# Altium project COB with RK3399.PrjPcb (part 4 of 5)

## Sheet MIPI CSI 0 and 1 Connectors.SchDoc: RK3399 COB Design V1.0
size A3; Author: ABC; Organization: Altium Limited; Address1: L3, 12a Rodborough Rd; Address2: Frenchs Forest; Address3: NSW; Address4: Australia 2086; DocumentNumber: 22; SheetNumber: 22; SheetTotal: 27; PROJECT CODE: A_V1.0
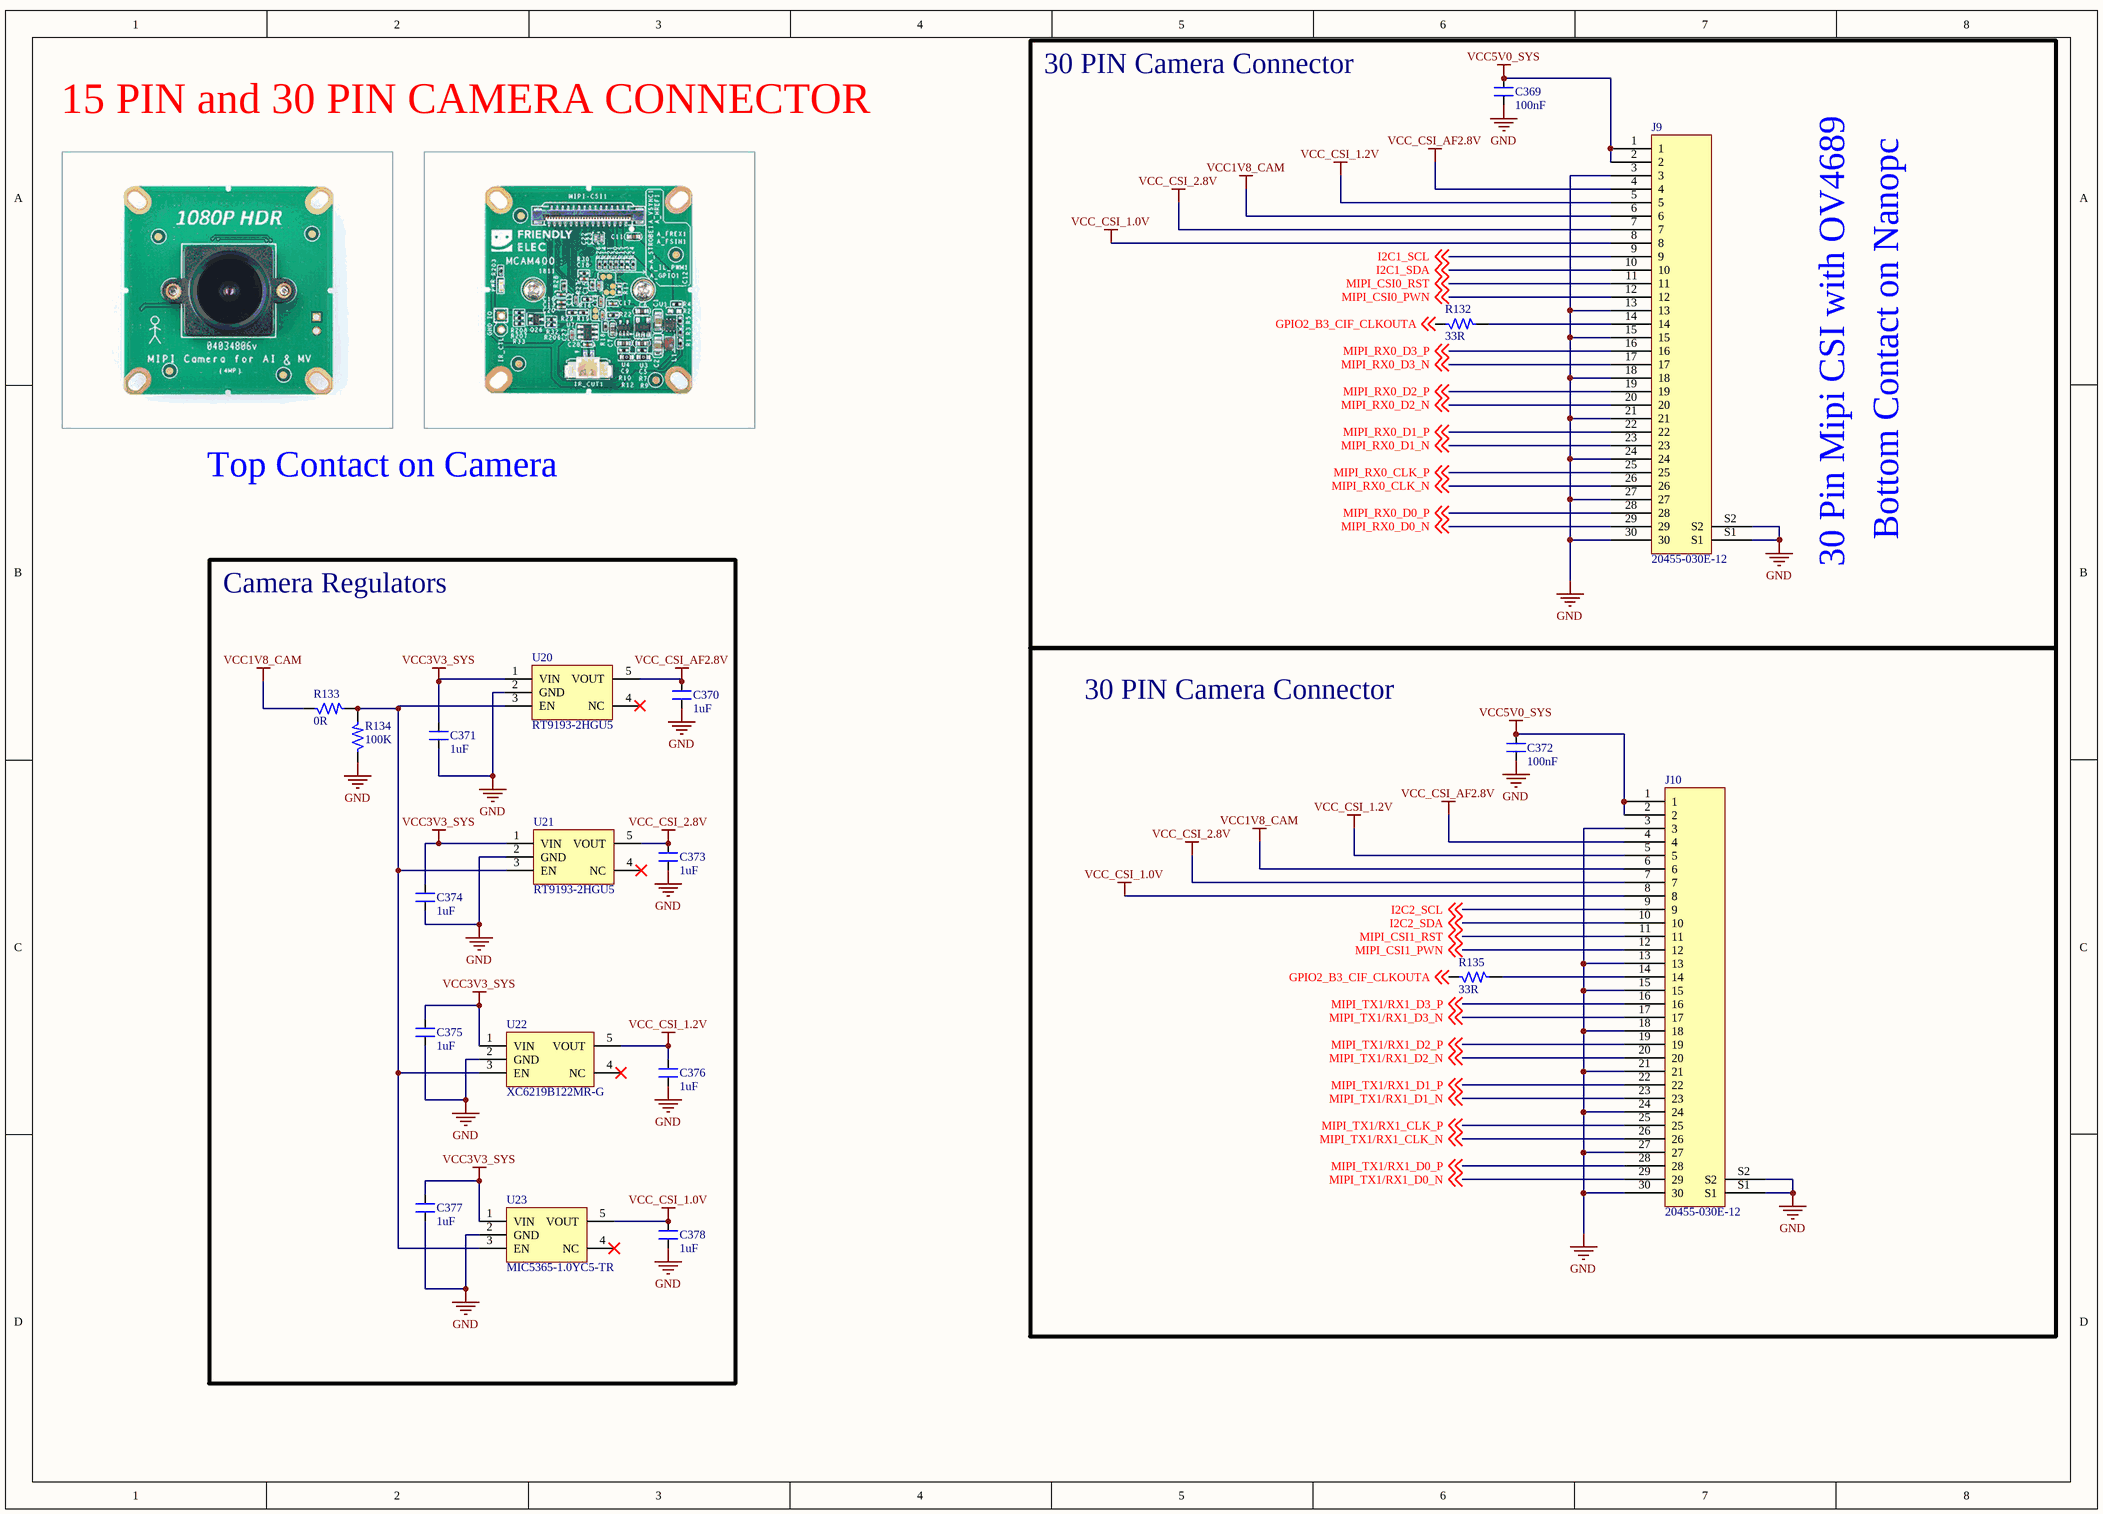
[diagram p21: MIPI CSI 0 and 1 Connectors.SchDoc]

### Parts
C369  100nF  [CAP_0603]
C370  1uF  [CAP_0603]
C371  1uF  [CAP_0603]
C372  100nF  [CAP_0603]
C373  1uF  [CAP_0603]
C374  1uF  [CAP_0603]
C375  1uF  [CAP_0603]
C376  1uF  [CAP_0603]
C377  1uF  [CAP_0603]
C378  1uF  [CAP_0603]
J9  20455-030E-12  [CON30_19_68713014522 _SMD_RA]
J10  20455-030E-12  [CON30_19_68713014522 _SMD_RA]
R132  33R  [RES_0402]
R133  0R  [RES_0603]
R134  100K  [RES_0603]
R135  33R  [RES_0402]
U20  RT9193-2HGU5  [SOT23-5]
U21  RT9193-2HGU5  [SOT23-5]
U22  XC6219B122MR-G  [SOT23-5]
U23  MIC5365-1.0YC5-TR  [SOT23-5]

### Blocks framed on the sheet
Camera Regulators: C370 C371 C373-C378 R133 R134 U20-U23
30 PIN Camera Connector: C372 J10 R135

### Nets
GND: C369.1 C370.1 C371.1 C372.1 C373.1 C374.1 C375.1 C376.1 C377.1 C378.1 J9.3 J9.13 J9.15 J9.18 J9.21 J9.24 J9.27 J9.30 J9.S1 J9.S2 J10.3 J10.13 J10.15 J10.18 J10.21 J10.24 J10.27 J10.30 J10.S1 J10.S2 R134.1 U20.2(GND) U21.2(GND) U22.2(GND) U23.2(GND)
VCC1V8_CAM: J9.6 J10.6 R133.1
VCC3V3_SYS: C371.2 C374.2 C375.2 C377.2 U20.1(VIN) U21.1(VIN) U22.1(VIN) U23.1(VIN)
VCC5V0_SYS: C369.2 C372.2 J9.1 J9.2 J10.1 J10.2
VCC_CSI_1.0V: C378.2 J9.8 J10.8 U23.5(VOUT)
VCC_CSI_1.2V: C376.2 J9.5 J10.5 U22.5(VOUT)
VCC_CSI_2.8V: C373.2 J9.7 J10.7 U21.5(VOUT)
VCC_CSI_AF2.8V: C370.2 J9.4 J10.4 U20.5(VOUT)
GPIO2_B3_CIF_CLKOUTA: R132.1 R135.1 ; off-sheet GPIO2_B3_CIF_CLKOUTA
I2C1_SCL: J9.9 ; off-sheet I2C1_SCL
I2C1_SDA: J9.10 ; off-sheet I2C1_SDA
I2C2_SCL: J10.9 ; off-sheet I2C2_SCL
I2C2_SDA: J10.10 ; off-sheet I2C2_SDA
MIPI_CSI0_PWN: J9.12 ; off-sheet MIPI_CSI0_PWN
MIPI_CSI0_RST: J9.11 ; off-sheet MIPI_CSI0_RST
MIPI_CSI1_PWN: J10.12 ; off-sheet MIPI_CSI1_PWN
MIPI_CSI1_RST: J10.11 ; off-sheet MIPI_CSI1_RST
MIPI_RX0_CLK_N: J9.26 ; off-sheet MIPI_RX0_CLK_N
MIPI_RX0_CLK_P: J9.25 ; off-sheet MIPI_RX0_CLK_P
MIPI_RX0_D0_N: J9.29 ; off-sheet MIPI_RX0_D0_N
MIPI_RX0_D0_P: J9.28 ; off-sheet MIPI_RX0_D0_P
MIPI_RX0_D1_N: J9.23 ; off-sheet MIPI_RX0_D1_N
MIPI_RX0_D1_P: J9.22 ; off-sheet MIPI_RX0_D1_P
MIPI_RX0_D2_N: J9.20 ; off-sheet MIPI_RX0_D2_N
MIPI_RX0_D2_P: J9.19 ; off-sheet MIPI_RX0_D2_P
MIPI_RX0_D3_N: J9.17 ; off-sheet MIPI_RX0_D3_N
MIPI_RX0_D3_P: J9.16 ; off-sheet MIPI_RX0_D3_P
MIPI_TX1/RX1_CLK_N: J10.26 ; off-sheet MIPI_TX1/RX1_CLK_N
MIPI_TX1/RX1_CLK_P: J10.25 ; off-sheet MIPI_TX1/RX1_CLK_P
MIPI_TX1/RX1_D0_N: J10.29 ; off-sheet MIPI_TX1/RX1_D0_N
MIPI_TX1/RX1_D0_P: J10.28 ; off-sheet MIPI_TX1/RX1_D0_P
MIPI_TX1/RX1_D1_N: J10.23 ; off-sheet MIPI_TX1/RX1_D1_N
MIPI_TX1/RX1_D1_P: J10.22 ; off-sheet MIPI_TX1/RX1_D1_P
MIPI_TX1/RX1_D2_N: J10.20 ; off-sheet MIPI_TX1/RX1_D2_N
MIPI_TX1/RX1_D2_P: J10.19 ; off-sheet MIPI_TX1/RX1_D2_P
MIPI_TX1/RX1_D3_N: J10.17 ; off-sheet MIPI_TX1/RX1_D3_N
MIPI_TX1/RX1_D3_P: J10.16 ; off-sheet MIPI_TX1/RX1_D3_P
NetJ9_14: J9.14 R132.2
NetJ10_14: J10.14 R135.2
NetR133_2: R133.2 R134.2 U20.3(EN) U21.3(EN) U22.3(EN) U23.3(EN)

Not connected (* = marked no-connect by the designer): U20 4(NC)*; U21 4(NC)*; U22 4(NC)*; U23 4(NC)*

### Notes on the sheet
- 15 PIN and 30 PIN CAMERA CONNECTOR
- 30 PIN Camera Connector
- Top Contact on Camera
- 30 Pin Mipi CSI with OV4689
- Bottom Contact on Nanopc
- TITLE:
- DOCUMENT NAME:
- SCALE 1:1
- This document is copyright of Esteempcb and shall not be revealed, produced, copied, in whole or in part, nor
- PROJECT CODE:
- TEMPLATE:
- A3
- AUTHOR:
- Sheet
- of
- used for any purpose other than submitted.

### Library data of the parts
C369 C372 = CAP_100nF-10V-5%-0603: 0.1µF ±10% 10V Ceramic Capacitor X7R 0603 (1608 Metric) /; Manufacturer: Yageo; Manufacturer Part Number: CC0603KRX7R6BB104; Case/Package: 0603; Supplier-1: Digikey
C370 C371 C373-C378 = CAP_1uF-10V-5%-0603: 1µF ±10% 10V Ceramic Capacitor X5R 0603 (1608 Metric) /; Manufacturer: Samsung Electro-Mechanics; Manufacturer Part Number: CL10A105KP8NNNC; Case/Package: 0603; Supplier-1: Digikey
J9 J10 = CON-PLG-FPC_30X1-19-RA-BC-SMD: FFC & FPC Connectors 0.5 FPC EASYON BTM CONT RA 30CKT ZIF; Manufacturer: WE; Manufacturer Part Number: 68713014522; Case/Package: SMD; Supplier-1: Mouser
R132 R135 = RES_33R-0.1W-1%-0402: 33 Ohms ±1% 0.1W, 1/10W Chip Resistor 0402 (1005 Metric) Automotive AEC-Q200 Thick Film /; Manufacturer: Panasonic Electronic Components; Manufacturer Part Number: ERJ-2RKF33R0X; Case/Package: 0402; Supplier-1: Digikey
R133 = RES_0R-0.1W-1%-0603: as R95 on sheet Power Supply for CPU Blocks; Case/Package: 0603; Supplier-1: Digikey
R134 = RES_100K-0.1W-1%-0603: 100 kOhms ±1% 0.1W, 1/10W Chip Resistor 0603 (1608 Metric) Automotive AEC-Q200 Thick Film /; Manufacturer: tackpole Electronics Inc; Manufacturer Part Number: RMCF0603FT100K; Case/Package: 0603; Supplier-1: Digikey
U20 U21 = REG_2.5V-5.5V-0.3A-SC-70-5: Fixed LDO Voltage Regulator, 2.5V to 5.5V, 220mV Dropout, 2.85Vout, 300mAout, SC-70-5; Manufacturer: RICHTEK; Manufacturer Part Number: RT9193-2HGU5; Case/Package: SC-70; Supplier-1: Element 14
U22 = REG_1.2V-6V-0.15A-SOT-25-5: LDO Voltage Regulators; Manufacturer: Torex Semiconductor; Manufacturer Part Number: XC6219B122MR-G; Case/Package: SOT-25-5; Supplier-1: Mouser
U23 = REG_1V-5.5V-0.15A-SC-70-5: LDO Voltage Regulators Ultra Small Single 150mA LDO; Manufacturer: Microchip Technology / Micrel; Manuafcturer Part Number: MIC5365-1.0YC5-TR; Case/Package: SC-70-5; Supplier-1: Mouser

## Sheet EDP and MIPI DSI Connectors.SchDoc: RK3399 COB Design V1.0
size A3; Author: ABC; Organization: Altium Limited; Address1: L3, 12a Rodborough Rd; Address2: Frenchs Forest; Address3: NSW; Address4: Australia 2086; DocumentNumber: 23; SheetNumber: 23; SheetTotal: 27; PROJECT CODE: A_V1.0
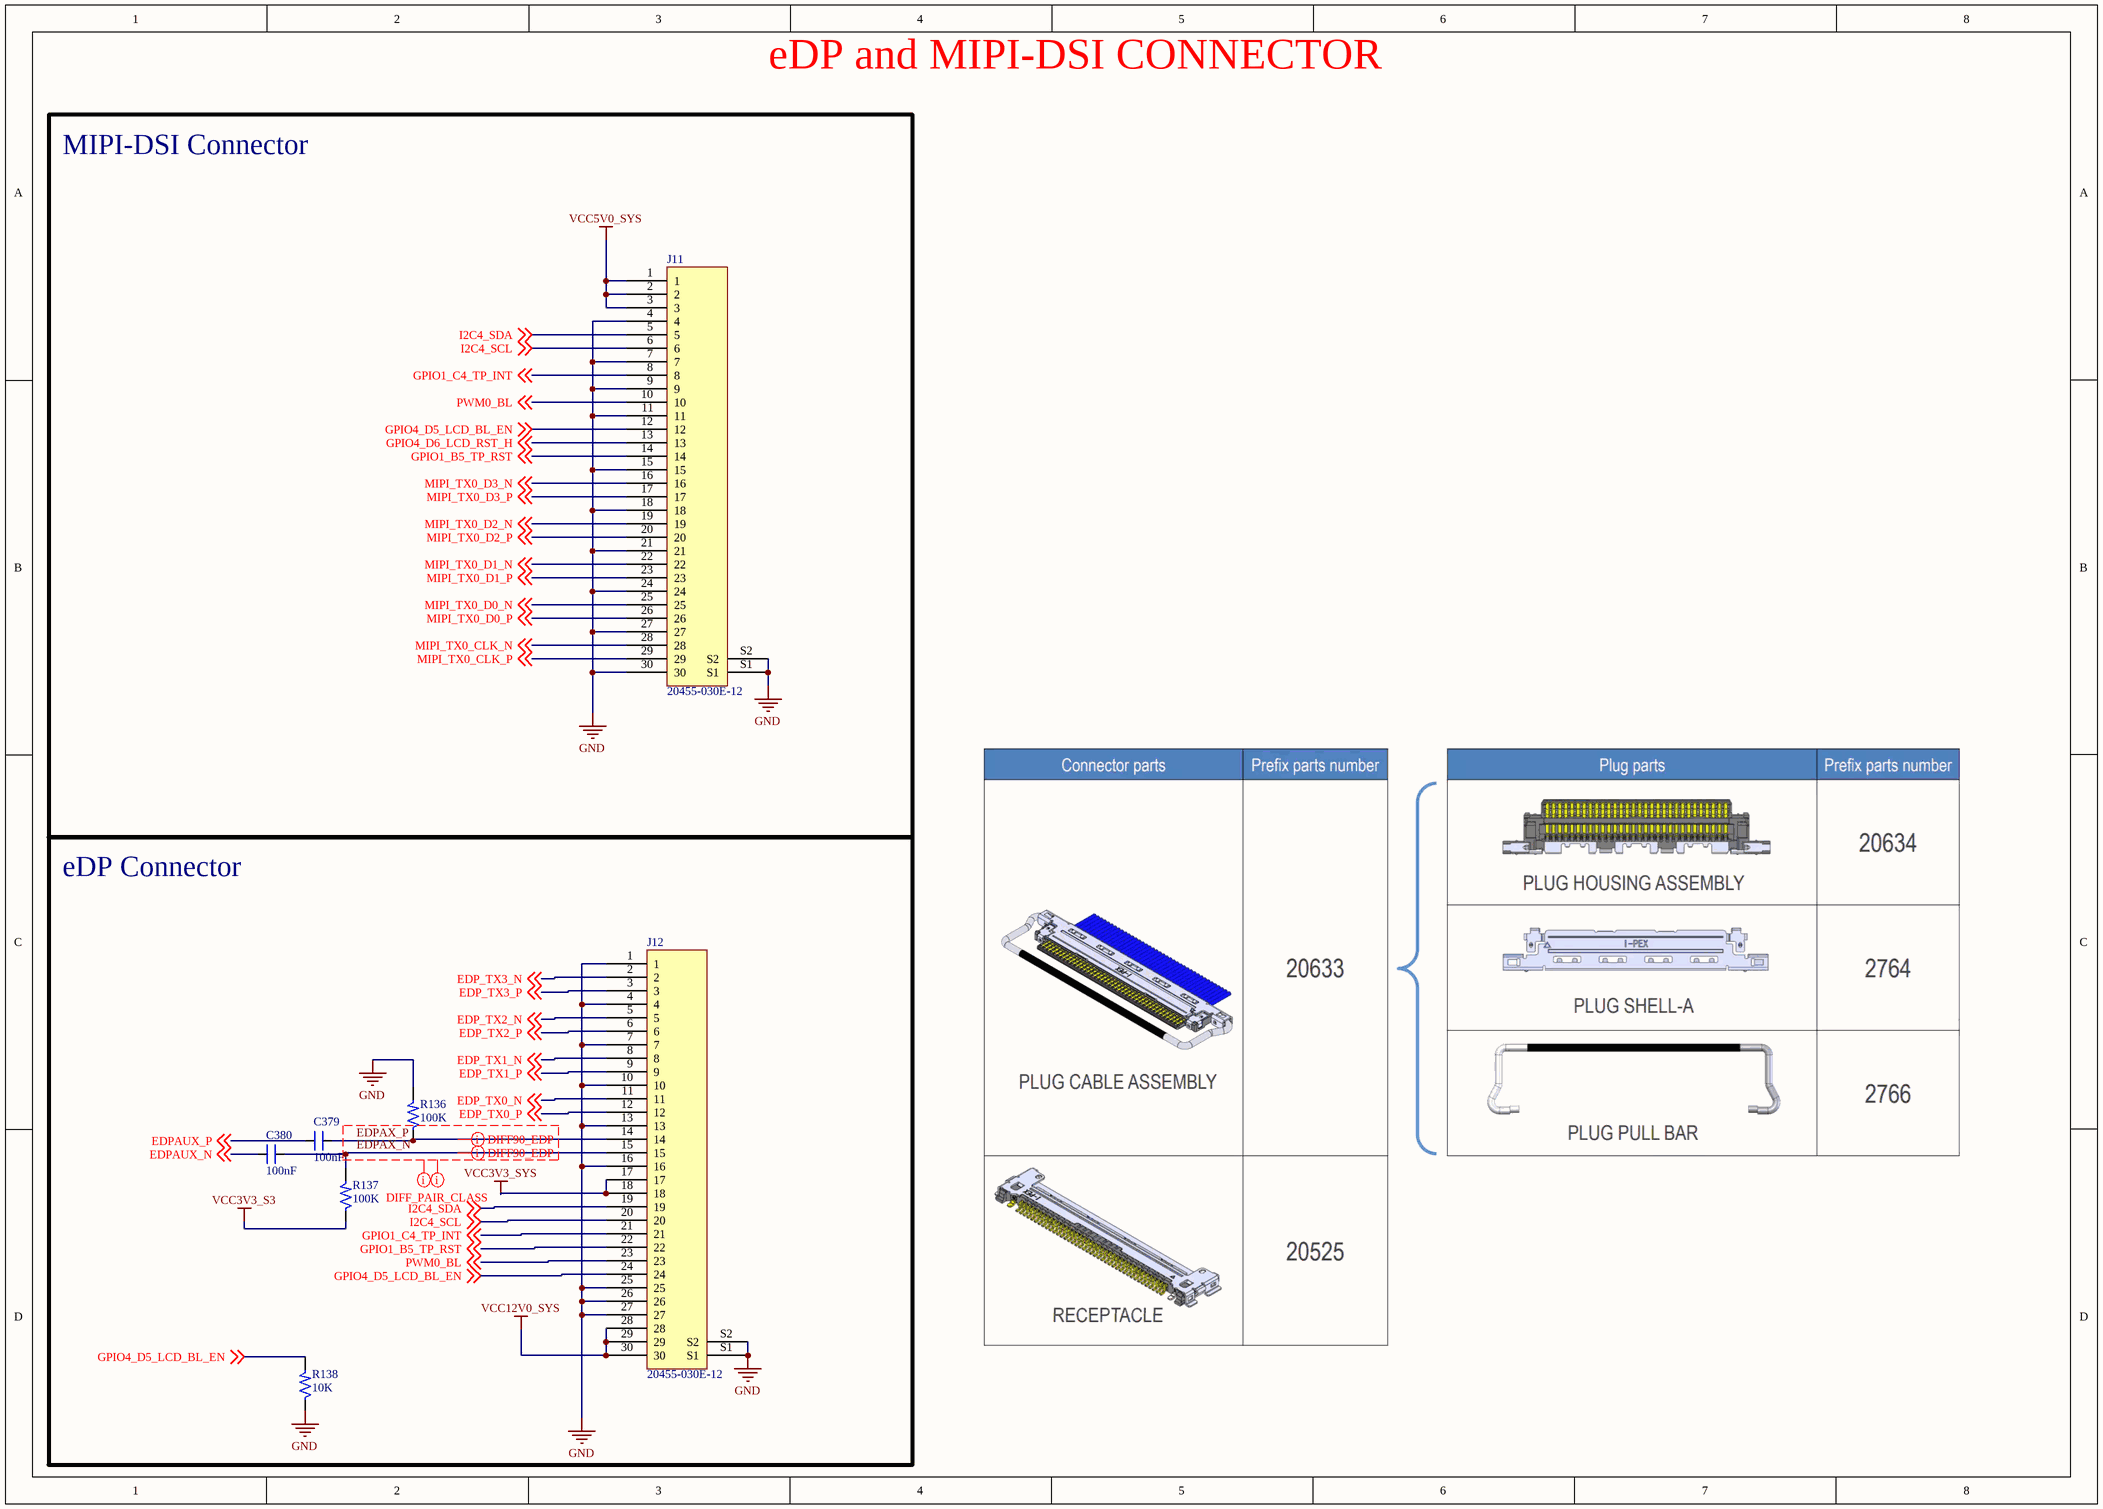
[diagram p22: EDP and MIPI DSI Connectors.SchDoc]

### Parts
C379  100nF  [CAP_0402]
C380  100nF  [CAP_0402]
J11  20455-030E-12  [CON30_19_68713014522 _SMD_RA]
J12  20455-030E-12  [CON30_19_68713014522 _SMD_RA]
R136  100K  [RES_0603]
R137  100K  [RES_0603]
R138  10K  [RES_0603]

### Blocks framed on the sheet
MIPI-DSI Connector: J11
eDP Connector: C379 C380 J12 R136-R138

### Nets
GND: J11.4 J11.7 J11.9 J11.11 J11.15 J11.18 J11.21 J11.24 J11.27 J11.30 J11.S1 J11.S2 J12.1 J12.4 J12.7 J12.10 J12.13 J12.16 J12.25 J12.26 J12.27 J12.S1 J12.S2 R136.2 R138.1
VCC3V3_S3: R137.1
VCC3V3_SYS: J12.17 J12.18
VCC5V0_SYS: J11.1 J11.2 J11.3
VCC12V0_SYS: J12.28 J12.29 J12.30
EDP_TX0_N: J12.11 ; off-sheet EDP_TX0_N
EDP_TX0_P: J12.12 ; off-sheet EDP_TX0_P
EDP_TX1_N: J12.8 ; off-sheet EDP_TX1_N
EDP_TX1_P: J12.9 ; off-sheet EDP_TX1_P
EDP_TX2_N: J12.5 ; off-sheet EDP_TX2_N
EDP_TX2_P: J12.6 ; off-sheet EDP_TX2_P
EDP_TX3_N: J12.2 ; off-sheet EDP_TX3_N
EDP_TX3_P: J12.3 ; off-sheet EDP_TX3_P
EDPAUX_N: C380.1 ; off-sheet EDPAUX_N
EDPAUX_P: C379.1 ; off-sheet EDPAUX_P
EDPAX_N: C380.2 J12.15 R137.2
EDPAX_P: C379.2 J12.14 R136.1
GPIO1_B5_TP_RST: J11.14 J12.22 ; off-sheet GPIO1_B5_TP_RST
GPIO1_C4_TP_INT: J11.8 J12.21 ; off-sheet GPIO1_C4_TP_INT
GPIO4_D5_LCD_BL_EN: J11.12 J12.24 R138.2 ; off-sheet GPIO4_D5_LCD_BL_EN
GPIO4_D6_LCD_RST_H: J11.13 ; off-sheet GPIO4_D6_LCD_RST_H
I2C4_SCL: J11.6 J12.20 ; off-sheet I2C4_SCL
I2C4_SDA: J11.5 J12.19 ; off-sheet I2C4_SDA
MIPI_TX0_CLK_N: J11.28 ; off-sheet MIPI_TX0_CLK_N
MIPI_TX0_CLK_P: J11.29 ; off-sheet MIPI_TX0_CLK_P
MIPI_TX0_D0_N: J11.25 ; off-sheet MIPI_TX0_D0_N
MIPI_TX0_D0_P: J11.26 ; off-sheet MIPI_TX0_D0_P
MIPI_TX0_D1_N: J11.22 ; off-sheet MIPI_TX0_D1_N
MIPI_TX0_D1_P: J11.23 ; off-sheet MIPI_TX0_D1_P
MIPI_TX0_D2_N: J11.19 ; off-sheet MIPI_TX0_D2_N
MIPI_TX0_D2_P: J11.20 ; off-sheet MIPI_TX0_D2_P
MIPI_TX0_D3_N: J11.16 ; off-sheet MIPI_TX0_D3_N
MIPI_TX0_D3_P: J11.17 ; off-sheet MIPI_TX0_D3_P
PWM0_BL: J11.10 J12.23 ; off-sheet PWM0_BL

### Layout directives
differential pair; differential pair class DIFF90_EDP: EDPAX_N, EDPAX_P
net class EDP SIG. GROUP: EDPAX_N, EDPAX_P
net class DIFF_PAIR_CLASS: EDPAX_N, EDPAX_P

### Notes on the sheet
- eDP and MIPI-DSI CONNECTOR
- TITLE:
- DOCUMENT NAME:
- SCALE 1:1
- This document is copyright of Esteempcb and shall not be revealed, produced, copied, in whole or in part, nor
- PROJECT CODE:
- TEMPLATE:
- A3
- AUTHOR:
- Sheet
- of
- used for any purpose other than submitted.

### Library data of the parts
C379 C380 = CAP_100nF-10V-10%-0402: as C350 on sheet TYPEC0 Connector; Case/Package: 0402; Supplier-1: Digikey
J11 J12 = CON-PLG-eDP_30X120455-030E-12-SMD: Micro Coaxial Connector 0.5mm Pitch; Manufacturer: RS Components; Mating Part Number: 687730200002; Alternate Part Number-1: NA; Manufacturer Part Number: 20455-030E-12; Case/Package: SMD; Supplier-1: Mouser; Supplier Part Number-1: 68713014522
R136 R137 = RES_100K-0.1W-1%-0603: as R134 on sheet MIPI CSI 0 and 1 Connectors; Case/Package: 0603; Supplier-1: Digikey
R138 = RES_10K-0.1W-1%-0603: as R69 on sheet Regulators and Buck Converters; Case/Package: 0603; Supplier-1: Digikey

## Sheet CODEC and Headphone Jack.SchDoc: RK3399 COB Design V1.0
size A3; Author: AVIRAL MISHRA; DocumentNumber: 24; SheetNumber: 24; SheetTotal: 27; PROJECT CODE: A_V1.0
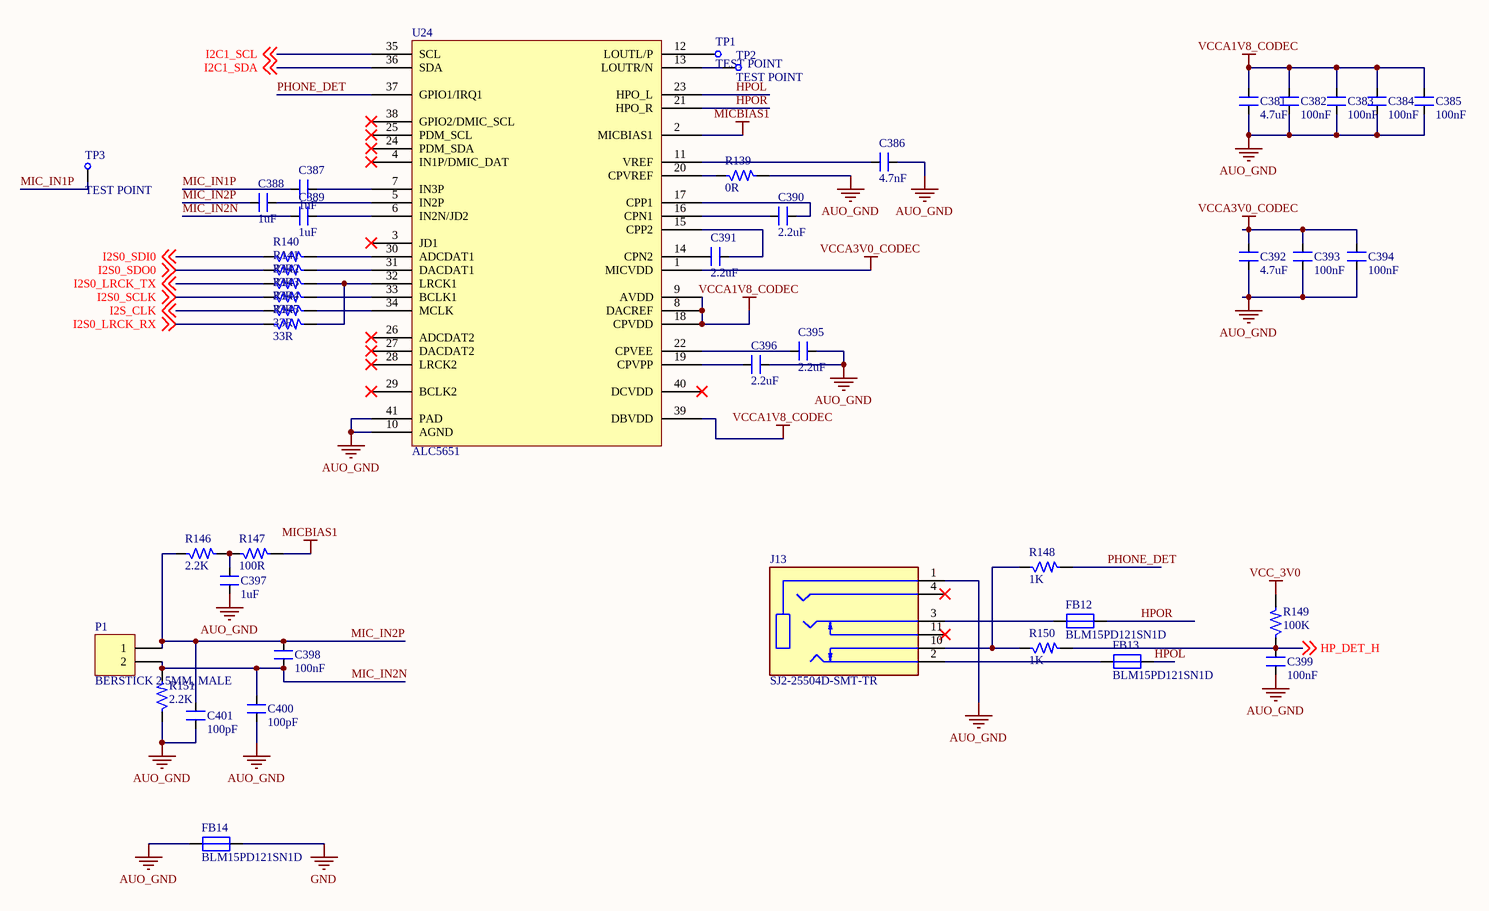
[diagram p23: CODEC and Headphone Jack.SchDoc]

### Parts
C381  4.7uF  [CAP_0603]
C382  100nF  [CAP_0603]
C383  100nF  [CAP_0603]
C384  100nF  [CAP_0603]
C385  100nF  [CAP_0603]
C386  4.7nF  [CAP_0603]
C387  1uF  [CAP_0402]
C388  1uF  [CAP_0402]
C389  1uF  [CAP_0402]
C390  2.2uF  [CAP_0402]
C391  2.2uF  [CAP_0402]
C392  4.7uF  [CAP_0603]
C393  100nF  [CAP_0603]
C394  100nF  [CAP_0603]
C395  2.2uF  [CAP_0402]
C396  2.2uF  [CAP_0402]
C397  1uF  [CAP_0603]
C398  100nF  [CAP_0603]
C399  100nF  [CAP_0603]
C400  100pF  [CAP_0603]
C401  100pF  [CAP_0603]
FB12  BLM15PD121SN1D  [RES_0402]
FB13  BLM15PD121SN1D  [RES_0402]
FB14  BLM15PD121SN1D  [RES_0402]
J13  SJ2-25504D-SMT-TR  [CON11_SJ2-25504D-SMT-TR_TH_RA]
P1  BERSTICK 2.5MM, MALE  [CON2_100_43D62_TH_ST]
R139  0R  [RES_0603]
R140  33R  [RES_0402]
R141  33R  [RES_0402]
R142  33R  [RES_0402]
R143  33R  [RES_0402]
R144  33R  [RES_0402]
R145  33R  [RES_0402]
R146  2.2K  [RES_0603]
R147  100R  [RES_0603]
R148  1K  [RES_0603]
R149  100K  [RES_0603]
R150  1K  [RES_0603]
R151  2.2K  [RES_0603]
TP1  TEST POINT  [TEST POINT_30]
TP2  TEST POINT  [TEST POINT_30]
TP3  TEST POINT  [TEST POINT_30]
U24  ALC5651  [QFN40_15.7_227X227_SMD]

### Nets
AUO_GND: C381.1 C382.1 C383.1 C384.1 C385.1 C386.2 C392.1 C393.1 C394.1 C395.2 C396.2 C397.1 C399.1 C400.1 C401.1 FB14.1 J13.1(SLEEVE) R139.2 R151.1 U24.10(AGND) U24.41(PAD)
GND: FB14.2
MICBIAS1: R147.2 U24.2(MICBIAS1)
VCC_3V0: R149.2
VCCA1V8_CODEC: C381.2 C382.2 C383.2 C384.2 C385.2 U24.8(DACREF) U24.9(AVDD) U24.18(CPVDD) U24.39(DBVDD)
VCCA3V0_CODEC: C392.2 C393.2 C394.2 U24.1(MICVDD)
HP_DET_H: C399.2 R149.1 R150.2 ; off-sheet HP_DET_H
HPOL: FB13.2 U24.23(HPO_L)
HPOR: FB12.2 U24.21(HPO_R)
I2C1_SCL: U24.35(SCL) ; off-sheet I2C1_SCL
I2C1_SDA: U24.36(SDA) ; off-sheet I2C1_SDA
I2S0_LRCK_RX: R145.1 ; off-sheet I2S0_LRCK_RX
I2S0_LRCK_TX: R142.1 ; off-sheet I2S0_LRCK_TX
I2S0_SCLK: R143.1 ; off-sheet I2S0_SCLK
I2S0_SDI0: R140.1 ; off-sheet I2S0_SDI0
I2S0_SDO0: R141.1 ; off-sheet I2S0_SDO0
I2S_CLK: R144.1 ; off-sheet I2S_CLK
MIC_IN1P: C387.1 TP3.1
MIC_IN2N: C389.1 C398.1 C400.2 P1.2 R151.2
MIC_IN2P: C388.1 C398.2 C401.2 P1.1 R146.1
PHONE_DET: R148.2 U24.37(GPIO1/IRQ1)
NetC386_1: C386.1 U24.11(VREF)
NetC387_2: C387.2 U24.7(IN3P)
NetC388_2: C388.2 U24.5(IN2P)
NetC389_2: C389.2 U24.6(IN2N/JD2)
NetC390_1: C390.1 U24.16(CPN1)
NetC390_2: C390.2 U24.17(CPP1)
NetC391_1: C391.1 U24.14(CPN2)
NetC391_2: C391.2 U24.15(CPP2)
NetC395_1: C395.1 U24.22(CPVEE)
NetC396_1: C396.1 U24.19(CPVPP)
NetC397_2: C397.2 R146.2 R147.1
NetFB12_1: FB12.1 J13.3(RING1)
NetFB13_1: FB13.1 J13.2(TIP)
NetJ13_10: J13.10(TIP_SWITCH) R148.1 R150.1
NetR139_1: R139.1 U24.20(CPVREF)
NetR140_2: R140.2 U24.30(ADCDAT1)
NetR141_2: R141.2 U24.31(DACDAT1)
NetR142_2: R142.2 R145.2 U24.32(LRCK1)
NetR143_2: R143.2 U24.33(BCLK1)
NetR144_2: R144.2 U24.34(MCLK)
NetTP1_1: TP1.1 U24.12(LOUTL/P)
NetTP2_1: TP2.1 U24.13(LOUTR/N)

Not connected (* = marked no-connect by the designer): J13 4(RING2)* 11(RING1_SWITCH)*; U24 3(JD1)* 4(IN1P/DMIC_DAT)* 24(PDM_SDA)* 25(PDM_SCL)* 26(ADCDAT2)* 27(DACDAT2)* 28(LRCK2)* 29(BCLK2)* 38(GPIO2/DMIC_SCL)* 40(DCVDD)*

### Notes on the sheet
- TITLE:
- DOCUMENT NAME:
- SCALE 1:1
- This document is copyright of EsteemPCB and shall not be revealed, produced, copied, in whole or in part, nor
- PROJECT CODE:
- TEMPLATE:
- A4
- AUTHOR:
- Sheet
- of
- used for any purpose other than submitted.

### Library data of the parts
C381 C392 = CAP_4.7uF-16V-10%-0603: as C337 on sheet RGMII ETH PHY; Case/Package: 0603; Supplier-1: Digikey
C382-C385 C393 C394 C398 C399 = CAP_100nF-10V-5%-0603: as C369 on sheet MIPI CSI 0 and 1 Connectors; Case/Package: 0603; Supplier-1: Digikey
C386 = CAP_4.7nF-10V-10%-0603: 4700pF ±10% 10V Ceramic Capacitor X7R 0603 (1608 Metric) /; Manufacturer: KEMET; Manufacturer Part Number: C0603C472K8RACTU; Case/Package: 0603; Supplier-1: Digikey
C387-C389 = CAP_1uF-10V-10%-0402: 1µF ±10% 10V Ceramic Capacitor X6S 0402 (1005 Metric) /; Manufacturer: Murata Electronics; Manufacturer Part Number: GRT155C81A105KE01D; Case/Package: 0402; Supplier-1: Digikey
C390 C391 C395 C396 = CAP_2.2uF-10V-10%-0402: 2.2µF ±10% 10V Ceramic Capacitor X5R 0402 (1005 Metric) /; Manufacturer: Murata Electronics; Manufacturer Part Number: GRM155R61A225KE95D; Case/Package: 0402; Supplier-1: Digikey
C397 = CAP_1uF-10V-5%-0603: as C370 on sheet MIPI CSI 0 and 1 Connectors; Case/Package: 0603; Supplier-1: Digikey
C400 C401 = CAP_100pF-10V-10%-0603: 100pF ±10% 10V Ceramic Capacitor X7R 0603 (1608 Metric) /; Manufacturer: AVX Corporation; Manufacturer Part Number: 0603ZC101KAT2A; Case/Package: 0603; Supplier-1: Digikey
FB12-FB14 = FB_120R-1.3A-100Mhz-0402: 120 Ohms @ 100MHz 1 Power Line Ferrite Bead 0402 (1005 Metric) 1.3A 90mOhm; Manufacturer: Murata Electronics; Mnaufacturer Part Number: BLM15PD121SN1D; Case/Package: 0402; Supplier-1: Digikey
J13 = CON-PLG_SJ2-25504D-SMT-TR-RA-TH: 2.5 mm, Stereo, Right Angle, Surface Mount (SMT), 4 Conductors, 2 Internal Switches, Audio Jack Connector; Manufacturer: CUI Devices; Manufacturer Part Number: SJ2-25504D-SMT-TR; Case/Package: SMD; Supplier-1: Digikey
P1 = CON-BS-PLG_2X1-100-ST-TH: 2 Pins, 1 Row 2.54mm Pitch, Straight bergstrip, Male; Manufacturer Part Number: NA; Manufacturer: Samtec; Case/Package: TH-CON; Supplier-1: SP ROAD
R139 = RES_0R-0.1W-1%-0603: as R95 on sheet Power Supply for CPU Blocks; Case/Package: 0603; Supplier-1: Digikey
R140-R145 = RES_33R-0.1W-1%-0402: as R132 on sheet MIPI CSI 0 and 1 Connectors; Case/Package: 0402; Supplier-1: Digikey
R146 R151 = RES_2.2K-0.1W-1%-0603: 2.2 kOhms ±1% 0.1W, 1/10W Chip Resistor 0603 (1608 Metric) Thick Film /; Manufacturer: Yageo; Manufacturer Part Number: RC0603FR-072K2L; Case/Package: 0603; Supplier-1: Digikey
R147 = RES_100R-0.1W-1%-0603: as R76 on sheet Power Supply for CPU Blocks; Case/Package: 0603; Supplier-1: Digikey
R148 R150 = RES_1K-0.1W-1%-0603: as R124 on sheet TYPEC0 Connector; Case/Package: 0603; Supplier-1: Digikey
R149 = RES_100K-0.1W-1%-0603: as R134 on sheet MIPI CSI 0 and 1 Connectors; Case/Package: 0603; Supplier-1: Digikey
TP1-TP3 = TEST POINT: 0.4mm hole size Test point; Manufacturer Part Number: NA; Case/Package: TH; Manufacturer: NA; Supplier-1: NA
U24 = IC_ALC5651: Ultra-Low Power Two-Channel Audio CODEC / with SounzRealTM Digital Sound Effect / for Mobile Devices; Manufacturer: Realtek; Manufacturer Part Number: ALC5651; Case/Package: PQFA-45; Supplier-1: NA

## Sheet SD Card and Debug Uart.SchDoc: RK3399 COB Design V1.0
size A3; Author: AVIRAL MISHRA; DocumentNumber: 25; SheetNumber: 25; SheetTotal: 27; PROJECT CODE: A_V1.0
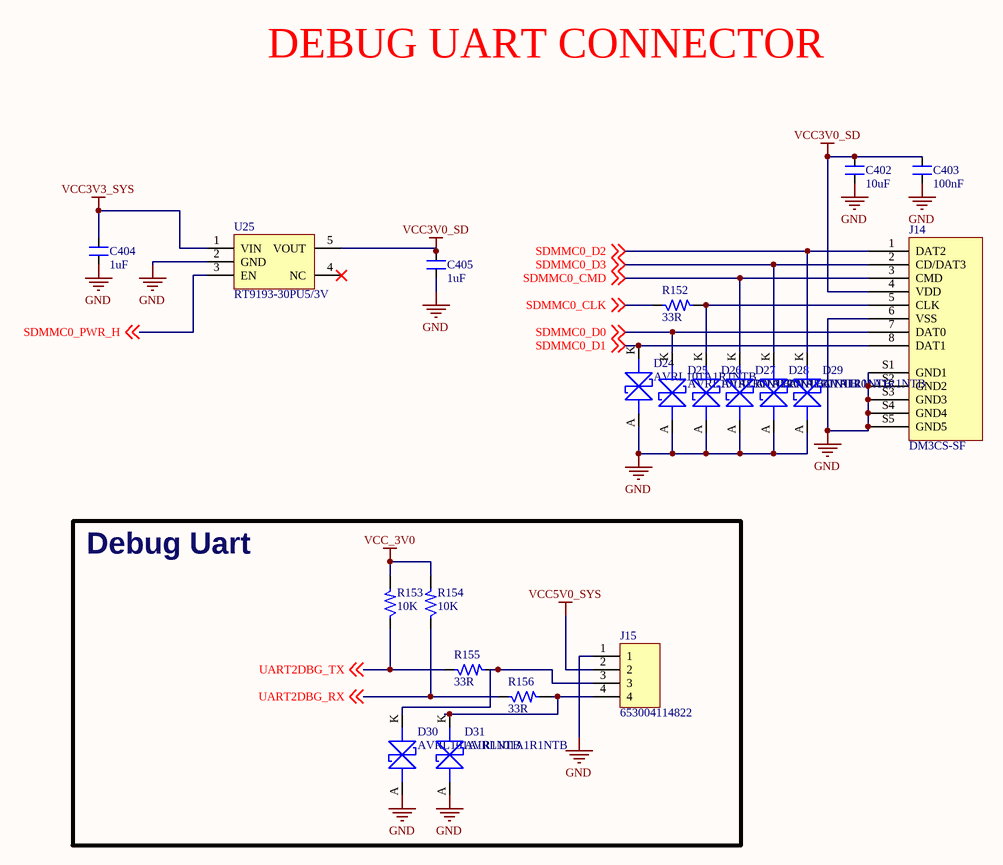
[diagram p24: SD Card and Debug Uart.SchDoc]

### Parts
C402  10uF  [CAP_0603]
C403  100nF  [CAP_0603]
C404  1uF  [CAP_0603]
C405  1uF  [CAP_0603]
D24  AVRL101A1R1NTB  [DIO_0402_SMD]
D25  AVRL101A1R1NTB  [DIO_0402_SMD]
D26  AVRL101A1R1NTB  [DIO_0402_SMD]
D27  AVRL101A1R1NTB  [DIO_0402_SMD]
D28  AVRL101A1R1NTB  [DIO_0402_SMD]
D29  AVRL101A1R1NTB  [DIO_0402_SMD]
D30  AVRL101A1R1NTB  [DIO_0402_SMD]
D31  AVRL101A1R1NTB  [DIO_0402_SMD]
J14  DM3CS-SF  [CON8_43_DM3CS-SF_SMD]
J15  653004114822  [CON4_50_653004114822_TH_ST]
R152  33R  [RES_0402]
R153  10K  [RES_0603]
R154  10K  [RES_0603]
R155  33R  [RES_0402]
R156  33R  [RES_0402]
U25  RT9193-30PU5/3V  [SOT23-5]

### Blocks framed on the sheet
Debug Uart: D30 D31 J15 R153-R156

### Nets
GND: C402.1 C403.1 C404.1 C405.1 D24.A D25.A D26.A D27.A D28.A D29.A D30.A D31.A J14.6(VSS) J14.S1(GND1) J14.S2(GND2) J14.S3(GND3) J14.S4(GND4) J14.S5(GND5) J15.1 U25.2(GND)
VCC3V0_SD: C402.2 C403.2 C405.2 J14.4(VDD) U25.5(VOUT)
VCC3V3_SYS: C404.2 U25.1(VIN)
VCC5V0_SYS: J15.2
VCC_3V0: R153.2 R154.2
SDMMC0_CLK: R152.1 ; off-sheet SDMMC0_CLK
SDMMC0_CMD: D27.K J14.3(CMD) ; off-sheet SDMMC0_CMD
SDMMC0_D0: D25.K J14.7(DAT0) ; off-sheet SDMMC0_D0
SDMMC0_D1: D24.K J14.8(DAT1) ; off-sheet SDMMC0_D1
SDMMC0_D2: D29.K J14.1(DAT2) ; off-sheet SDMMC0_D2
SDMMC0_D3: D28.K J14.2(CD/DAT3) ; off-sheet SDMMC0_D3
SDMMC0_PWR_H: U25.3(EN) ; off-sheet SDMMC0_PWR_H
UART2DBG_RX: R154.1 R156.1 ; off-sheet UART2DBG_RX
UART2DBG_TX: R153.1 R155.1 ; off-sheet UART2DBG_TX
NetD26_K: D26.K J14.5(CLK) R152.2
NetD30_K: D30.K J15.3 R155.2
NetD31_K: D31.K J15.4 R156.2

Not connected (* = marked no-connect by the designer): U25 4(NC)*

### Notes on the sheet
- DEBUG UART CONNECTOR
- TITLE:
- DOCUMENT NAME:
- SCALE 1:1
- This document is copyright of EsteemPCB and shall not be revealed, produced, copied, in whole or in part, nor
- PROJECT CODE:
- TEMPLATE:
- A4
- AUTHOR:
- Sheet
- of
- used for any purpose other than submitted.

### Library data of the parts
C402 = CAP_10uF-10V-10%-0603: as C309 on sheet Power Supply for CPU Blocks; Case/Package: 0603; Supplier-1: Digikey
C403 = CAP_100nF-10V-5%-0603: as C369 on sheet MIPI CSI 0 and 1 Connectors; Case/Package: 0603; Supplier-1: Digikey
C404 C405 = CAP_1uF-10V-5%-0603: as C370 on sheet MIPI CSI 0 and 1 Connectors; Case/Package: 0603; Supplier-1: Digikey
D24-D31 = DIO-T_10V-39V-0402: 39V Varistor 1 Circuit Surface Mount, MLCV 0402 (1005 Metric); Manufacturer: TDK Corporation; Manufacturer Part Number: AVRL101A1R1NTB; Supplier-1: Digikey; Case/Package: 0402
J14 = CON-uSD-8X1_DM3CS-SF-SMD: Memory Card Connectors 8P R/A SMT MICRO SD HINGE PUSH-PULL; Manufacturer: Hirose Electric Co Ltd; Manufacturer Part Number: DM3CS-SF; Case/Package: SMD; Supplier-1: Digikey
J15 = CON-PLG_4X1-50-ST-TH: 4 Pins, 1 Row 1.25mm Pitch, straight Connector, male; Manufacturer: JST; Manufacturer Part Number: 653004114822; Case/Package: TH-CON; Supplier-1: WURTH
R152 R155 R156 = RES_33R-0.1W-1%-0402: as R132 on sheet MIPI CSI 0 and 1 Connectors; Case/Package: 0402; Supplier-1: Digikey
R153 R154 = RES_10K-0.1W-1%-0603: as R69 on sheet Regulators and Buck Converters; Case/Package: 0603; Supplier-1: Digikey
U25 = REG_3V-5.5V-0.3A-SC-70-5: The RT9193 is designed for portable RF and wireless / applications with demanding performance and space / requirements; Manufcaturer: RICHTEK; Manufacturer Part Number: RT9193-30PU5/3V; Case/Package: SC-70-5; Supplier-1: NA

## Sheet 40 Pin BS, FAN Connector and Test LEDs.SchDoc: RK3399 COB Design V1.0
size A3; Author: ABC; Organization: Altium Limited; Address1: L3, 12a Rodborough Rd; Address2: Frenchs Forest; Address3: NSW; Address4: Australia 2086; DocumentNumber: 26; SheetNumber: 26; SheetTotal: 27; PROJECT CODE: A_V1.0
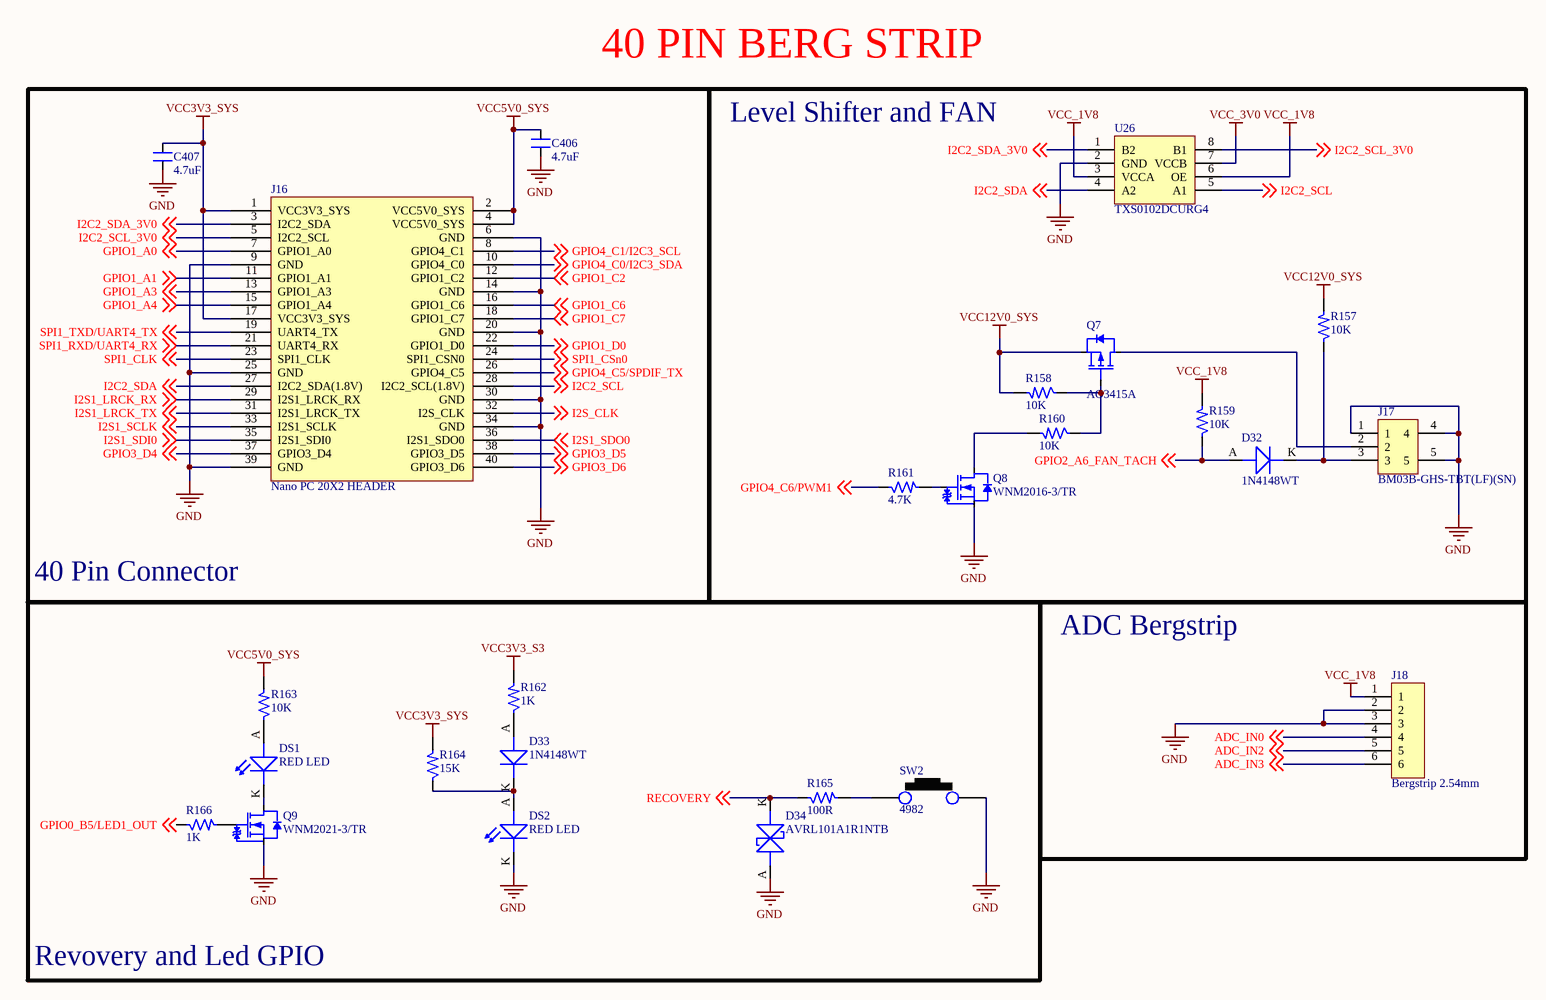
[diagram p25: 40 Pin BS, FAN Connector and Test LEDs.SchDoc]

### Parts
C406  4.7uF  [CAP_0603]
C407  4.7uF  [CAP_0603]
D32  1N4148WT  [DIO_SOD523]
D33  1N4148WT  [DIO_SOD523]
D34  AVRL101A1R1NTB  [DIO_0402_SMD]
DS1  RED LED  [LED_0805]
DS2  RED LED  [LED_0805]
J16  Nano PC 20X2 HEADER  [CON40_100_ADA2223_ST_TH]
J17  BM03B-GHS-TBT(LF)(SN)  [CON3_50_BM03B-GHS-TBT(LF)(SN)_TH_RA]
J18  Bergstrip 2.54mm  [CON6_100_59D78_TH_ST]
Q7  AO3415A  [SOT 23-3]
Q8  WNM2016-3/TR  [SOT 23-3]
Q9  WNM2021-3/TR  [SOT-323-3]
R157  10K  [RES_0603]
R158  10K  [RES_0603]
R159  10K  [RES_0603]
R160  10K  [RES_0603]
R161  4.7K  [RES_0603]
R162  1K  [RES_0603]
R163  10K  [RES_0603]
R164  15K  [RES_0603]
R165  100R  [RES_0603]
R166  1K  [RES_0603]
SW2  4982  [SW_177_39.3X77.7_SMD]
U26  TXS0102DCURG4  [VSSOP-8_19.6_157_33X11_SMD]

### Blocks framed on the sheet
40 Pin Connector: C406 C407 J16
Level Shifter and FAN: D32 J17 Q7 Q8 R157-R161 U26
Revovery and Led GPIO: D33 D34 DS1 DS2 Q9 R162-R166 SW2
ADC Bergstrip: J18

### Nets
GND: C406.1 C407.1 D34.A DS2.K(CATHODE) J16.6(GND) J16.9(GND) J16.14(GND) J16.20(GND) J16.25(GND) J16.30(GND) J16.34(GND) J16.39(GND) J17.1 J17.4 J17.5 J18.2 J18.3 Q8.2(S) Q9.2(S) SW2.2 U26.2(GND)
VCC3V3_S3: R162.2
VCC3V3_SYS: C407.2 J16.1(VCC3V3_SYS) J16.17(VCC3V3_SYS) R164.2
VCC5V0_SYS: C406.2 J16.2(VCC5V0_SYS) J16.4(VCC5V0_SYS) R163.2
VCC12V0_SYS: Q7.2(S) R157.2 R158.2
VCC_1V8: J18.1 R159.2 U26.3(VCCA) U26.6(OE)
VCC_3V0: U26.7(VCCB)
ADC_IN0: J18.4 ; off-sheet ADC_IN0
ADC_IN2: J18.5 ; off-sheet ADC_IN2
ADC_IN3: J18.6 ; off-sheet ADC_IN3
GPIO0_B5/LED1_OUT: R166.1 ; off-sheet GPIO0_B5/LED1_OUT
GPIO1_A0: J16.7(GPIO1_A0) ; off-sheet GPIO1_A0
GPIO1_A1: J16.11(GPIO1_A1) ; off-sheet GPIO1_A1
GPIO1_A3: J16.13(GPIO1_A3) ; off-sheet GPIO1_A3
GPIO1_A4: J16.15(GPIO1_A4) ; off-sheet GPIO1_A4
GPIO1_C2: J16.12(GPIO1_C2) ; off-sheet GPIO1_C2
GPIO1_C6: J16.16(GPIO1_C6) ; off-sheet GPIO1_C6
GPIO1_C7: J16.18(GPIO1_C7) ; off-sheet GPIO1_C7
GPIO1_D0: J16.22(GPIO1_D0) ; off-sheet GPIO1_D0
GPIO2_A6_FAN_TACH: D32.A(ANODE) R159.1 ; off-sheet GPIO2_A6_FAN_TACH
GPIO3_D4: J16.37(GPIO3_D4) ; off-sheet GPIO3_D4
GPIO3_D5: J16.38(GPIO3_D5) ; off-sheet GPIO3_D5
GPIO3_D6: J16.40(GPIO3_D6) ; off-sheet GPIO3_D6
GPIO4_C0/I2C3_SDA: J16.10(GPIO4_C0) ; off-sheet GPIO4_C0/I2C3_SDA
GPIO4_C1/I2C3_SCL: J16.8(GPIO4_C1) ; off-sheet GPIO4_C1/I2C3_SCL
GPIO4_C5/SPDIF_TX: J16.26(GPIO4_C5) ; off-sheet GPIO4_C5/SPDIF_TX
GPIO4_C6/PWM1: R161.1 ; off-sheet GPIO4_C6/PWM1
I2C2_SCL: J16.28(I2C2_SCL(1.8V)) U26.5(A1) ; off-sheet I2C2_SCL
I2C2_SCL_3V0: J16.5(I2C2_SCL) U26.8(B1) ; off-sheet I2C2_SCL_3V0
I2C2_SDA: J16.27(I2C2_SDA(1.8V)) U26.4(A2) ; off-sheet I2C2_SDA
I2C2_SDA_3V0: J16.3(I2C2_SDA) U26.1(B2) ; off-sheet I2C2_SDA_3V0
I2S1_LRCK_RX: J16.29(I2S1_LRCK_RX) ; off-sheet I2S1_LRCK_RX
I2S1_LRCK_TX: J16.31(I2S1_LRCK_TX) ; off-sheet I2S1_LRCK_TX
I2S1_SCLK: J16.33(I2S1_SCLK) ; off-sheet I2S1_SCLK
I2S1_SDI0: J16.35(I2S1_SDI0) ; off-sheet I2S1_SDI0
I2S1_SDO0: J16.36(I2S1_SDO0) ; off-sheet I2S1_SDO0
I2S_CLK: J16.32(I2S_CLK) ; off-sheet I2S_CLK
RECOVERY: D34.K R165.1 ; off-sheet RECOVERY
SPI1_CLK: J16.23(SPI1_CLK) ; off-sheet SPI1_CLK
SPI1_CSn0: J16.24(SPI1_CSN0) ; off-sheet SPI1_CSn0
SPI1_RXD/UART4_RX: J16.21(UART4_RX) ; off-sheet SPI1_RXD/UART4_RX
SPI1_TXD/UART4_TX: J16.19(UART4_TX) ; off-sheet SPI1_TXD/UART4_TX
NetD32_K: D32.K(CATHODE) J17.3 R157.1
NetD33_A: D33.A(ANODE) R162.1
NetD33_K: D33.K(CATHODE) DS2.A(ANODE) R164.1
NetDS1_A: DS1.A(ANODE) R163.1
NetDS1_K: DS1.K(CATHODE) Q9.3(D)
NetJ17_2: J17.2 Q7.3(D)
NetQ7_1: Q7.1(G) R158.1 R160.1
NetQ8_1: Q8.1(G) R161.2
NetQ8_3: Q8.3(D) R160.2
NetQ9_1: Q9.1(G) R166.2
NetR165_2: R165.2 SW2.1

### Notes on the sheet
- 40 PIN BERG STRIP
- TITLE:
- DOCUMENT NAME:
- SCALE 1:1
- This document is copyright of Esteempcb and shall not be revealed, produced, copied, in whole or in part, nor
- PROJECT CODE:
- TEMPLATE:
- A3
- AUTHOR:
- Sheet
- of
- used for any purpose other than submitted.

### Library data of the parts
C406 C407 = CAP_4.7uF-16V-10%-0603: 4.7µF ±10% 16V Ceramic Capacitor X5R 0603 (1608 Metric) /; Manufacturer: Murata Electronics; Manufacturer Part Number: GRM188R61C475KAAJD; Case/Package: 0603; Supplier-1: Digikey
D32 D33 = DIO_75V-200mA-SOD-523F: Diode Standard 100V 300mA (DC) Surface Mount SOD-123; Manufacturer: FAIRCHILD; Manufacturer Part Number: 1N4148WT; Case/Package: SOD123; Supplier-1: SIRICOM
D34 = DIO-T_10V-39V-0402: 39V Varistor 1 Circuit Surface Mount, MLCV 0402 (1005 Metric); Manufacturer: TDK Corporation; Manufacturer Part Number: AVRL101A1R1NTB; Supplier-1: Digikey; Case/Package: 0402
DS1 DS2 = LED_RED-2V-20mA-0805: Red 631nm LED Indication - Discrete 2V 0805 (2012 Metric); Manufacturer: Vishay Lite-On; Manufacturer Part Number: LTST-C171KRKT; Case/Package: 0805; Supplier-1: SP ROAD
J16 = CON-BS-SKT_20X2-100-ST-TH: 40 Pins, 2 Row 2.54mm Pitch, Straight bergstrip, Female (Stackup); Manufacturer Part Number: ADA2223; Manufacturer: FCI / Amphenol; Case/Package: TH-CON; Supplier-1: TANOTIS
J17 = CON-PLG_3X1-50-RA-TH_1: Connector Header Surface Mount 3 position 0.049" (1.25mm); Manufacturer: JST Sales America Inc.; Nymble Part Number: 1EA-AA-0562; Mating Part Number: GHR-03V-S; Crimp Part Number: SSHL-002T-P0.2; Alternate Part Number-1: NA; Manufacturer Part Number: BM03B-GHS-TBT(LF)(SN); Case/Package: TH-CON; Supplier-1: Digikey; Supplier Part Number-1: BM03B-GHS-TBT(LF)(SN); Category: Connector; Number of Pins: 3
J18 = CON-BS-SKT_6X1-100-ST-TH: 6 Pins, 1 Row 2.54mm Pitch, Straight bergstrip, Female; Manufacturer: Molex; Manufacturer Part Number: 22-10-2061; Case/Package: TH-CON; Supplier-1: SP ROAD
Q7 = MOSFET-P_20V-5A-SOT23-3: P-Channel 20V 5A (Ta) 1.5W (Ta) Surface Mount SOT-23-3L; Manufacturer: Alpha & Omega Semiconductor Inc.; Manufacturer Part Number: AO3415A; Case/Package: SOT-23-3; Supplier-1: Digikey
Q8 = MOSFET-N_20V-2.9A-SOT-23: N Channel 20V 2.9A 1V @ 250uA 47mΩ @ 3.6A,4.5V 700mW SOT-23(SOT-23-3) MOSFET RoHS /; Manufacturer: WILLSEMI(Will Semicon); Manufacturer Part Number: WNM2016-3/TR; Case/Package: SOT-23(SOT-23-3); Supplier-1: LCSC
Q9 = MOSFET-N_20V-820mA-SOT-323: N Channel 20V 820mA 850mV @ 250uA 310mΩ @ 550mA,4.5V 310mW SOT-323(SC-70) MOSFET RoHS /; Manufacturer: WILLSEMI(Will Semicon); Manufacturer Part Number: WNM2021-3/TR; Case/Package: SOT-323(SC-70); Supplier-1: LCSC
R157-R160 R163 = RES_10K-0.1W-1%-0603: 10 kOhms ±1% 0.1W, 1/10W Chip Resistor 0603 (1608 Metric) Thick Film /; Manufacturer: Yageo; Manufacturer Part Number: RC0603FR-0710KL; Case/Package: 0603; Supplier-1: Digikey
R161 = RES_4.7K-0.1W-1%-0603: 4.7 kOhms ±1% 0.1W, 1/10W Chip Resistor 0603 (1608 Metric) Automotive AEC-Q200, Moisture Resistant Thick Film /; Manufacturer: TE Connectivity Passive Product; Manufacturer Part Number: CRGCQ0603F4K7; Case/Package: 0603; Supplier-1: Digikey
R162 R166 = RES_1K-0.1W-1%-0603: 1 kOhms ±1% 0.1W, 1/10W Chip Resistor 0603 (1608 Metric) Thick Film /; Manufacturer: Yageo; Manufacturer Part Number: RC0603FR-071KL; Case/Package: 0603; Supplier-1: Digikey
R164 = RES_15K-0.1W-1%-0603: 15 kOhms ±1% 0.1W, 1/10W Chip Resistor 0603 (1608 Metric) Thick Film /; Manufacturer: Yageo; Manufacturer Part Number: RC0603FR-0715KL; Suplier-1: Digikey; Case/Package: 0603
R165 = RES_100R-0.1W-1%-0603: 100 Ohms ±1% 0.1W, 1/10W Chip Resistor 0603 (1608 Metric) Thick Film /; Manufacturer: Yageo; Manufacturer Part Number: RC0603FR-07100RL; Case/Package: 0603; Supplier-1: Digikey
SW2 = SW1_4982: Tactile Switch 3x4x2mm SMD 2-Pin; Manufacturer: NA; Manufacturer Part Number: NA; Case/Package: SMD; Supplier-1: Sunrom
U26 = IC_TXS0102DCURG4: Voltage Level Translator Bidirectional 1 Circuit 2 Channel 24Mbps 8-VSSOP; Manufacturer: Texas Instruments; Manufacturer Part Number: TXS0102DCURG4; Case/Package: VSSOP8; Supplier-1: Mouser

## Sheet PCIE Connector.SchDoc: RK3399 COB Design V1.0
size A3; Author: AVIRAL MISHRA; DocumentNumber: 27; SheetNumber: 27; SheetTotal: 27; PROJECT CODE: A_V1.0
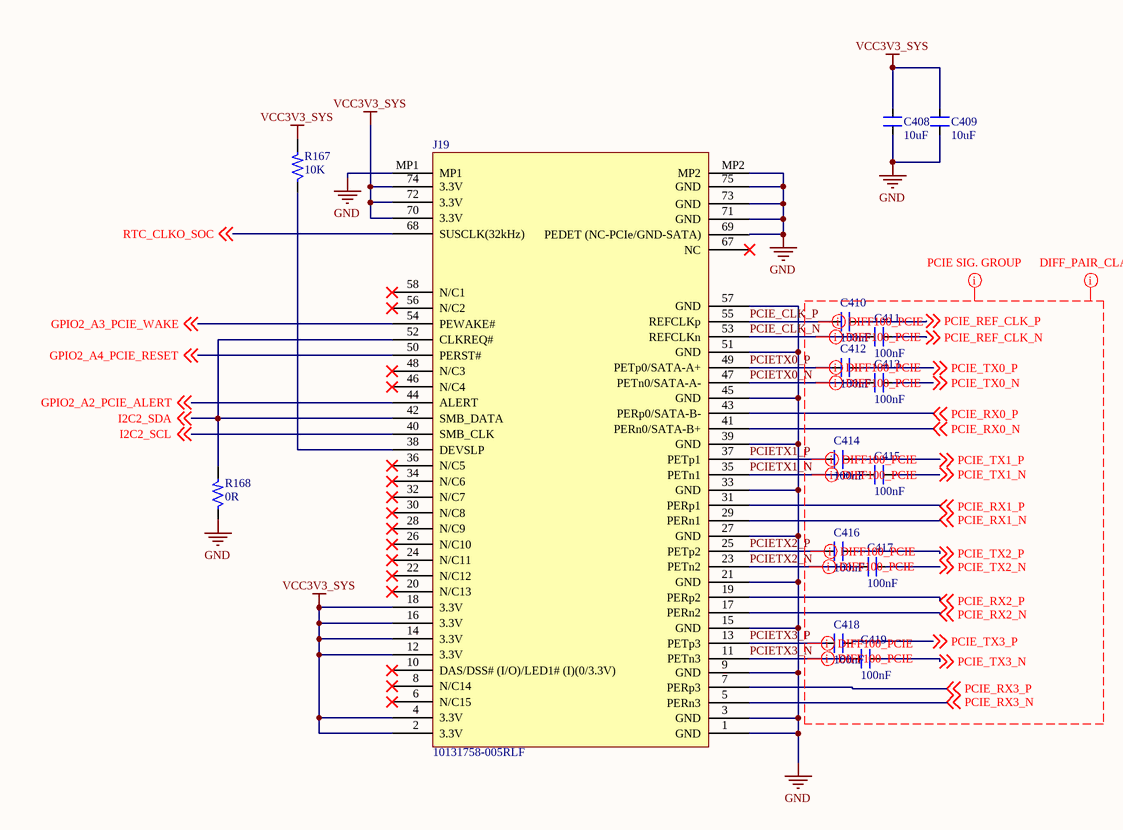
[diagram p26: PCIE Connector.SchDoc]

### Parts
C408  10uF  [CAP_0603]
C409  10uF  [CAP_0603]
C410  100nF  [CAP_0402]
C411  100nF  [CAP_0402]
C412  100nF  [CAP_0402]
C413  100nF  [CAP_0402]
C414  100nF  [CAP_0402]
C415  100nF  [CAP_0402]
C416  100nF  [CAP_0402]
C417  100nF  [CAP_0402]
C418  100nF  [CAP_0402]
C419  100nF  [CAP_0402]
J19  10131758-005RLF  [PCIE_10131758-005RLF]
R167  10K  [RES_0603]
R168  0R  [RES_0603]

### Nets
GND: C408.1 C409.1 J19.1(GND) J19.3(GND) J19.9(GND) J19.15(GND) J19.21(GND) J19.27(GND) J19.33(GND) J19.39(GND) J19.45(GND) J19.51(GND) J19.57(GND) J19.69(PEDET_(NC-PCIe/GND-SATA)) J19.71(GND) J19.73(GND) J19.75(GND) J19.MP1 J19.MP2 R168.1
VCC3V3_SYS: C408.2 C409.2 J19.2(3.3V) J19.4(3.3V) J19.12(3.3V) J19.14(3.3V) J19.16(3.3V) J19.18(3.3V) J19.70(3.3V) J19.72(3.3V) J19.74(3.3V) R167.2
GPIO2_A2_PCIE_ALERT: J19.44(ALERT) ; off-sheet GPIO2_A2_PCIE_ALERT
GPIO2_A3_PCIE_WAKE: J19.54(PEWAKE#) ; off-sheet GPIO2_A3_PCIE_WAKE
GPIO2_A4_PCIE_RESET: J19.50(PERST#) ; off-sheet GPIO2_A4_PCIE_RESET
I2C2_SCL: J19.40(SMB_CLK) ; off-sheet I2C2_SCL
I2C2_SDA: J19.42(SMB_DATA) J19.52(CLKREQ#) R168.2 ; off-sheet I2C2_SDA
PCIE_CLK_N: C411.1 J19.53(REFCLKn)
PCIE_CLK_P: C410.1 J19.55(REFCLKp)
PCIE_REF_CLK_N: C411.2 ; off-sheet PCIE_REF_CLK_N
PCIE_REF_CLK_P: C410.2 ; off-sheet PCIE_REF_CLK_P
PCIE_RX0_N: J19.41(PERn0/SATA-B+) ; off-sheet PCIE_RX0_N
PCIE_RX0_P: J19.43(PERp0/SATA-B-) ; off-sheet PCIE_RX0_P
PCIE_RX1_N: J19.29(PERn1) ; off-sheet PCIE_RX1_N
PCIE_RX1_P: J19.31(PERp1) ; off-sheet PCIE_RX1_P
PCIE_RX2_N: J19.17(PERn2) ; off-sheet PCIE_RX2_N
PCIE_RX2_P: J19.19(PERp2) ; off-sheet PCIE_RX2_P
PCIE_RX3_N: J19.5(PERn3) ; off-sheet PCIE_RX3_N
PCIE_RX3_P: J19.7(PERp3) ; off-sheet PCIE_RX3_P
PCIE_TX0_N: C413.2 ; off-sheet PCIE_TX0_N
PCIE_TX0_P: C412.2 ; off-sheet PCIE_TX0_P
PCIE_TX1_N: C415.2 ; off-sheet PCIE_TX1_N
PCIE_TX1_P: C414.2 ; off-sheet PCIE_TX1_P
PCIE_TX2_N: C417.2 ; off-sheet PCIE_TX2_N
PCIE_TX2_P: C416.2 ; off-sheet PCIE_TX2_P
PCIE_TX3_N: C419.2 ; off-sheet PCIE_TX3_N
PCIE_TX3_P: C418.2 ; off-sheet PCIE_TX3_P
PCIETX0_N: C413.1 J19.47(PETn0/SATA-A-)
PCIETX0_P: C412.1 J19.49(PETp0/SATA-A+)
PCIETX1_N: C415.1 J19.35(PETn1)
PCIETX1_P: C414.1 J19.37(PETp1)
PCIETX2_N: C417.1 J19.23(PETn2)
PCIETX2_P: C416.1 J19.25(PETp2)
PCIETX3_N: C419.1 J19.11(PETn3)
PCIETX3_P: C418.1 J19.13(PETp3)
RTC_CLKO_SOC: J19.68(SUSCLK(32kHz)) ; off-sheet RTC_CLKO_SOC
NetJ19_38: J19.38(DEVSLP) R167.1

Not connected (* = marked no-connect by the designer): J19 6(N/C15)* 8(N/C14)* 10(DAS/DSS#_(I/O)/LED1#_(I)(0/3.3V))* 20(N/C13)* 22(N/C12)* 24(N/C11)* 26(N/C10)* 28(N/C9)* 30(N/C8)* 32(N/C7)* 34(N/C6)* 36(N/C5)* 46(N/C4)* 48(N/C3)* 56(N/C2)* 58(N/C1)* 67(NC)*

### Layout directives
differential pair; differential pair class DIFF100_PCIE: PCIE_CLK_N, PCIE_CLK_P, PCIETX0_N, PCIETX0_P, PCIETX1_N, PCIETX1_P, PCIETX2_N, PCIETX2_P, PCIETX3_N, PCIETX3_P
net class PCIE SIG. GROUP: PCIE_REF_CLK_N, PCIE_REF_CLK_P, PCIE_RX0_N, PCIE_RX0_P, PCIE_RX1_N, PCIE_RX1_P, PCIE_RX2_N, PCIE_RX2_P, PCIE_RX3_N, PCIE_RX3_P, PCIE_TX0_N, PCIE_TX0_P, PCIE_TX1_N, PCIE_TX1_P, PCIE_TX2_N, PCIE_TX2_P, PCIE_TX3_N, PCIE_TX3_P
net class DIFF_PAIR_CLASS: PCIE_REF_CLK_N, PCIE_REF_CLK_P, PCIE_RX0_N, PCIE_RX0_P, PCIE_RX1_N, PCIE_RX1_P, PCIE_RX2_N, PCIE_RX2_P, PCIE_RX3_N, PCIE_RX3_P, PCIE_TX0_N, PCIE_TX0_P, PCIE_TX1_N, PCIE_TX1_P, PCIE_TX2_N, PCIE_TX2_P, PCIE_TX3_N, PCIE_TX3_P

### Notes on the sheet
- TITLE:
- DOCUMENT NAME:
- SCALE 1:1
- This document is copyright of EsteemPCB and shall not be revealed, produced, copied, in whole or in part, nor
- PROJECT CODE:
- TEMPLATE:
- A4
- AUTHOR:
- Sheet
- of
- used for any purpose other than submitted.

### Library data of the parts
C408 C409 = CAP_10uF-10V-10%-0603: 10µF ±10% 10V Ceramic Capacitor X5R 0603 (1608 Metric) /; Manufacturer Part Number: GRM188R61A106KE69J; Manufacturer: Murata Electronics; Case/Package: 0603; Supplier-1: Digikey
C410-C419 = CAP_100nF-10V-10%-0402: 0.1µF ±10% 10V Ceramic Capacitor X7R 0402 (1005 Metric) /; Manufacturer: Yageo; Manufacturer Part Number: CC0402KRX7R6BB104; Case/Package: 0402; Supplier-1: Digikey
J19 = CON-PLG_67X1-10131758-005RLF-SMD: PCI Express/PCI Connectors M.2 connector, 8.5H, M key; Manufacturer: Amphenol ICC (FCI); Manufacturer Part Number: 10131758-005RLF; Case/Package: M.2 8.5H_STD_M; Supplier-1: Digikey
R167 = RES_10K-0.1W-1%-0603: as R157-R160 on sheet 40 Pin BS, FAN Connector and Test LEDs; Case/Package: 0603; Supplier-1: Digikey
R168 = RES_0R-0.1W-1%-0603: 0 Ohms Jumper 0.1W, 1/10W Chip Resistor 0603 (1608 Metric) Thick Film; Manufacturer: Yageo; Manufacturer Part Number: RC0603JR-070RL; Case/Package: 0603; Supplier-1: Digikey